# Altium schematic sheet DSO_Power.SchDoc: Schematic_Name
size A4; CompanyName: University of Melbourne; Engineer: Your Name Here; DocumentNumber: 1; Revision: 0.1; SheetNumber: 1; SheetTotal: 1; Title_Project: Project_Title; StudentNo: Student No.
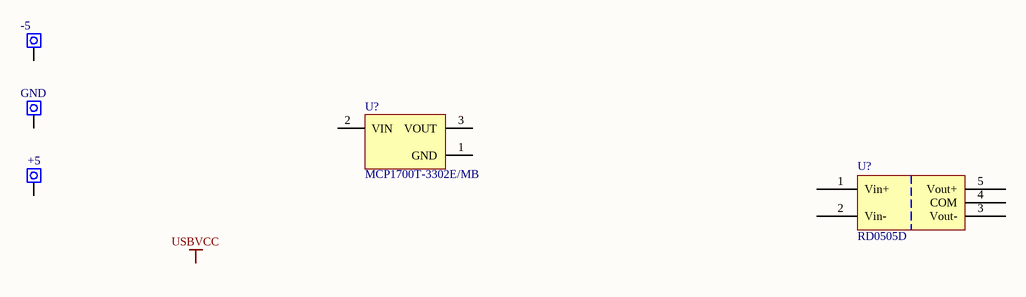
[diagram p0: DSO_Power.SchDoc]

## Parts
(Parts that share a designator on the sheet are numbered #1, #2 ... from top to bottom, then left to right.)
TP?#1  -5  [PIN 1.8mm]
TP?#2  GND  [PIN 1.8mm]
TP?#3  +5  [PIN 1.8mm]
U?#1  MCP1700T-3302E/MB  [SOT89]
U?#2  RD0505D  [SIP_NMG]

## Nets

Not connected (* = marked no-connect by the designer): TP?#1 1; TP?#2 1; TP?#3 1; U?#1 1(GND) 2(VIN) 3(VOUT); U?#2 1(Vin+) 2(Vin-) 3(Vout-) 4(COM) 5(Vout+)

## Notes on the sheet
- Labels drawn without touching a wire or pin: USBVCC

## Library data of the parts
TP?#1-TP?#3 = WIRE: Pad
U?#1 = MCP1700T: Low Quiescent Current LDO, 3-Pin SOT-89, Extended Temperature, Tape and Reel; Reviewed by: RM - 2018/08/05; Supplier 1: Digi-Key; Supplier Part Number 1: MCP1700T3302EMBCT-ND
U?#2 = RD0505D: (ADV) DC to DC converter 5V in +-5V out; Reviewed by: RM - 2018/08/05; Supplier Part Number 1: 945-1136-ND; Supplier 1: Digi-Key